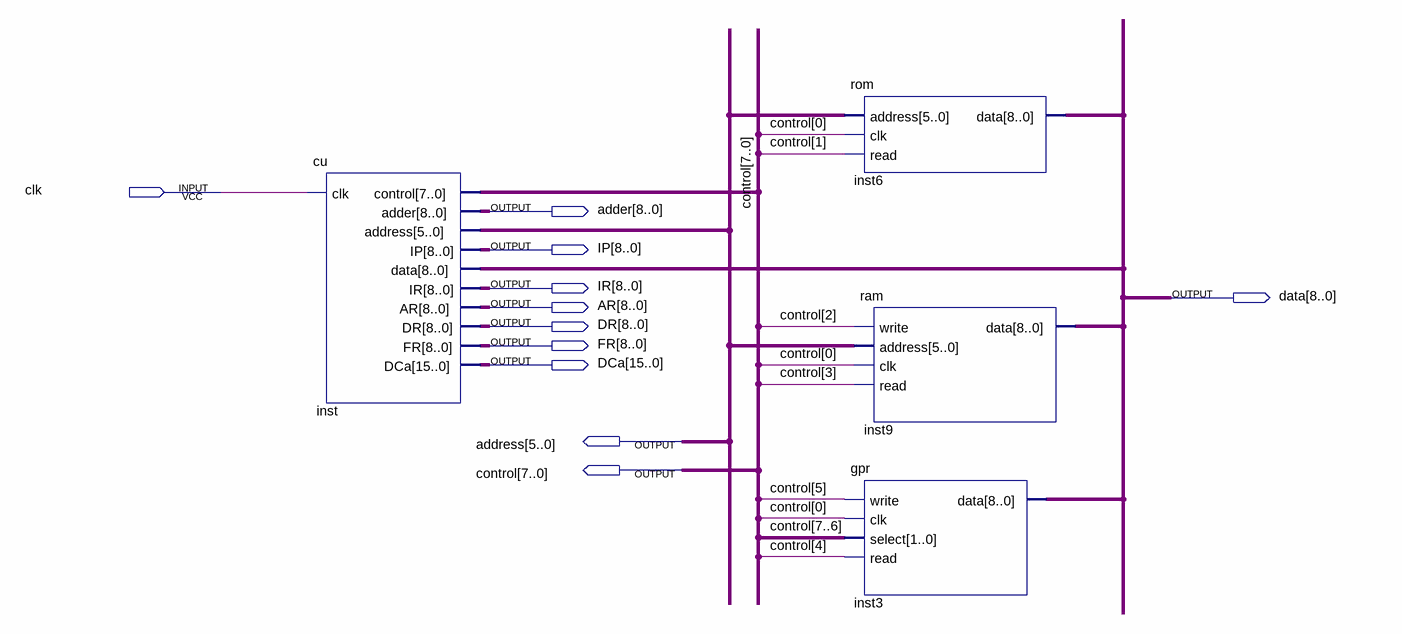
[diagram p0: schematic sheet]
// Quartus schematic lab4.bdf as structural Verilog: 4 symbols, 11 pins
module lab4 (
  input  clk,
  output [8:0] adder,
  output [8:0] IP,
  output [8:0] IR,
  output [8:0] data,
  output [8:0] AR,
  output [8:0] DR,
  output [8:0] FR,
  output [15:0] DCa,
  output [5:0] address,
  output [7:0] control
);

  cu inst (
    .clk(clk), .control(control), .adder(adder), .address(address), .IP(IP), .data(data), .IR(IR), .AR(AR),
    .DR(DR), .FR(FR), .DCa(DCa));
  rom inst6 (.address(address), .clk(control[0]), .read(control[1]), .data(data));
  ram inst9 (.write(control[2]), .address(address), .clk(control[0]), .read(control[3]), .data(data));
  gpr inst3 (.write(control[5]), .clk(control[0]), .select(control[7:6]), .read(control[4]), .data(data));
endmodule
